# Altium schematic sheet Power.SchDoc
size B
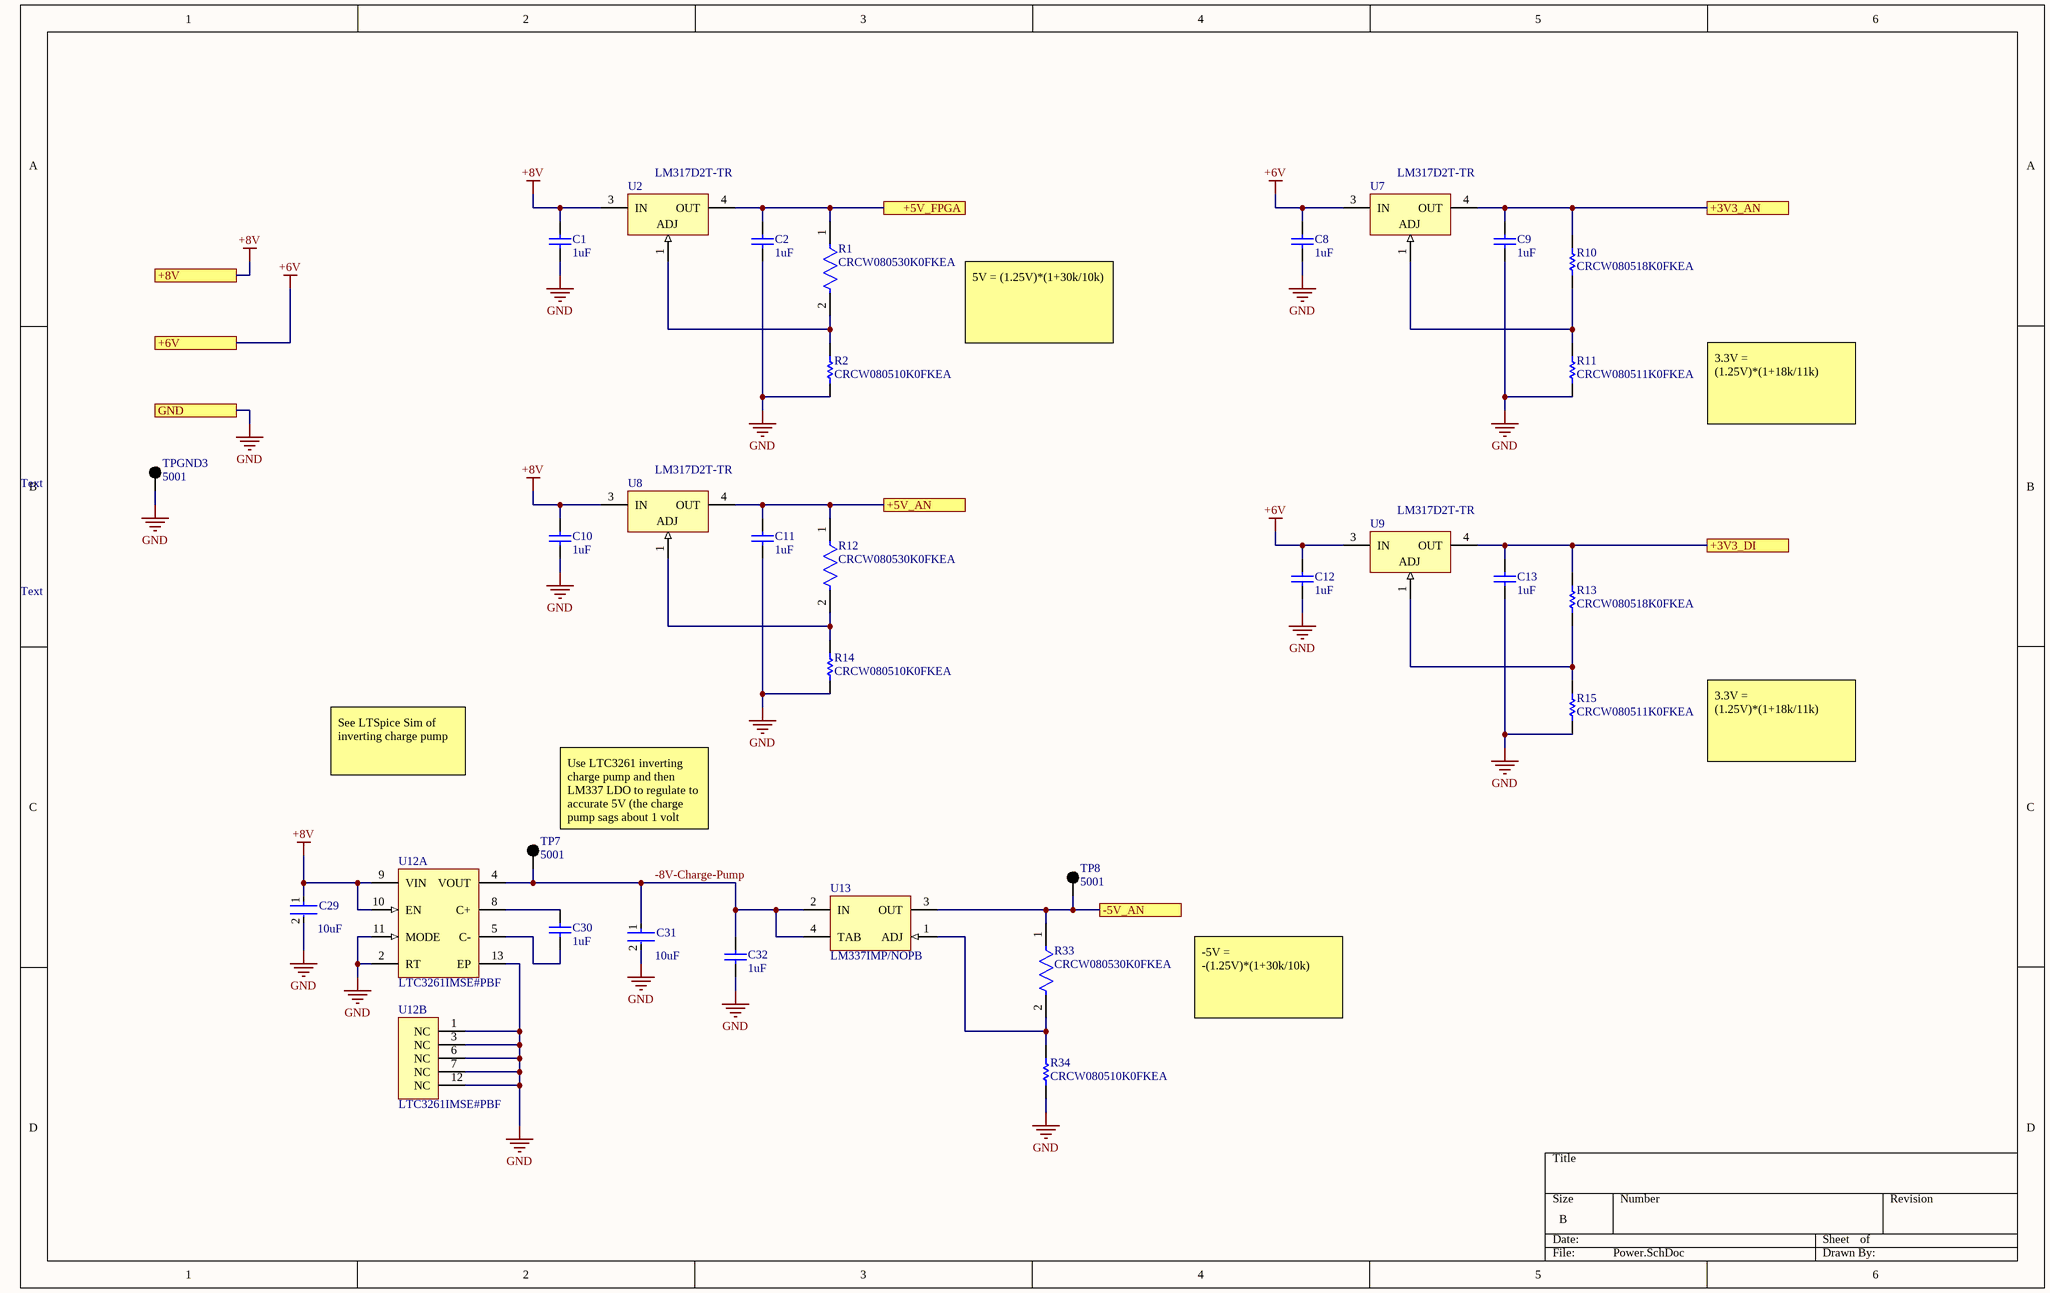
[diagram p0: Power.SchDoc]

## Parts
C1  1uF  [CAPC2013X100X50NL20T25]
C2  1uF  [CAPC2013X100X50NL20T25]
C8  1uF  [CAPC2013X100X50NL20T25]
C9  1uF  [CAPC2013X100X50NL20T25]
C10  1uF  [CAPC2013X100X50NL20T25]
C11  1uF  [CAPC2013X100X50NL20T25]
C12  1uF  [CAPC2013X100X50NL20T25]
C13  1uF  [CAPC2013X100X50NL20T25]
C29  Capacitance: 10uF  [FP-CGA5L-0_3-0_1-MFG]  (hidden comment: CGA5L1X7R1E106K160AC)
C30  1uF  [CAPC2013X100X50NL20T25]
C31  Capacitance: 10uF  [FP-CGA5L-0_3-0_1-MFG]  (hidden comment: CGA5L1X7R1E106K160AC)
C32  1uF  [CAPC2013X100X50NL20T25]
R1  CRCW080530K0FKEA  [FP-CRCW0805-e3-MFG]
R2  CRCW080510K0FKEA  [RESC2013X50X30NL20T20]
R10  CRCW080518K0FKEA  [RESC2013X50X30NL20T20]
R11  CRCW080511K0FKEA  [RESC2013X50X30NL20T20]
R12  CRCW080530K0FKEA  [FP-CRCW0805-e3-MFG]
R13  CRCW080518K0FKEA  [RESC2013X50X30NL20T20]
R14  CRCW080510K0FKEA  [RESC2013X50X30NL20T20]
R15  CRCW080511K0FKEA  [RESC2013X50X30NL20T20]
R33  CRCW080530K0FKEA  [FP-CRCW0805-e3-MFG]
R34  CRCW080510K0FKEA  [RESC2013X50X30NL20T20]
TP7  5001  [KSTN-5001]
TP8  5001  [KSTN-5001]
TPGND3  5001  [KSTN-5001]
U2  LM317D2T-TR  [TO-263_N]
U7  LM317D2T-TR  [TO-263_N]
U8  LM317D2T-TR  [TO-263_N]
U9  LM317D2T-TR  [TO-263_N]
U12  LTC3261IMSE#PBF  [LT-MSE-12-EDP_M]  (parts A,B of 2)
U13  LM337IMP/NOPB  [DCY0004A_L]

## Ports
+3V3_AN, +3V3_DI, +5V_AN, +5V_FPGA, +6V, +8V, -5V_AN, GND

## Nets
+6V: C8.2 C12.2 U7.3(IN) U9.3(IN) ; port +6V
+8V: C1.2 C10.2 C29.1 U2.3(IN) U8.3(IN) U12.9(VIN) U12.10(EN) ; port +8V
GND: C1.1 C2.1 C8.1 C9.1 C10.1 C11.1 C12.1 C13.1 C29.2 C31.2 C32.1 R2.2 R11.1 R14.2 R15.1 R34.2 TPGND3.1 U12.1(NC) U12.2(RT) U12.3(NC) U12.6(NC) U12.7(NC) U12.11(MODE) U12.12(NC) U12.13(EP) ; port GND
+3V3_AN: C9.2 R10.2 U7.4(OUT) ; port +3V3_AN
+3V3_DI: C13.2 R13.2 U9.4(OUT) ; port +3V3_DI
+5V_AN: C11.2 R12.1 U8.4(OUT) ; port +5V_AN
+5V_FPGA: C2.2 R1.1 U2.4(OUT) ; port +5V_FPGA
-5V_AN: R33.1 TP8.1 U13.3(OUT) ; port -5V_AN
-8V-Charge-Pump: C31.1 C32.2 TP7.1 U12.4(VOUT) U13.2(IN) U13.4(TAB)
NetC30_1: C30.1 U12.5(C-)
NetC30_2: C30.2 U12.8(C+)
NetR1_2: R1.2 R2.1 U2.1(ADJ)
NetR10_1: R10.1 R11.2 U7.1(ADJ)
NetR12_2: R12.2 R14.1 U8.1(ADJ)
NetR13_1: R13.1 R15.2 U9.1(ADJ)
NetR33_2: R33.2 R34.1 U13.1(ADJ)

## Notes on the sheet
- 5V = (1.25V)*(1+30k/10k)
- 3.3V = (1.25V)*(1+18k/11k)
- Text
- See LTSpice Sim of inverting charge pump
- (near TP7) Use LTC3261 inverting charge pump and then LM337 LDO to regulate to accurate 5V (the charge pump sags about 1 volt under load).
- -5V = -(1.25V)*(1+30k/10k)

## Library data of the parts
C1 C2 C8-C13 C30 C32 = CMP-2007-03716-1: Part Number: C0805X105K3RACTU; Manufacturer: Kemet
C29 C31 = CMP-08246-002126-1: Cap Ceramic 10uF 25V X7R 10% Pad SMD 1206 +125°C Automotive T/R; Case/Package: 1206; Thickness: 0.075inch; Ratings: AEC-Q200; Packaging: Tape and Reel; REACH SVHC: No SVHC; Composition: Ceramic; Tolerance: 10%; Depth: 1.6mm; Lead Free: Lead Free; Termination: SMD/SMT; Package Quantity: 1; Dielectric: X7R; Length: 3.2mm; Min Operating Temperature: -55°C; Voltage Rating: 25V; Max Operating Temperature: 125°C; Mount: Surface Mount; Case Code (Metric): 3216; Height: 1.6mm; Weight: 0.000571oz; Width: 0.063inch; Voltage Rating (DC): 25V; Case Code (Imperial): 1206
R1 R12 R33 = CMP-02407-008264-1: RES Thick Film, 30kΩ, 1%, 0.125W, 100ppm/°C, 0805; Max Power Dissipation: 125mW; Voltage Rating (DC): 150V; Resistance: 30kR; Contact Plating: Tin; Weight: 0.000194oz; Temperature Coefficient: 100ppm/°C; Packaging: Tape and Reel; Height: 0.45mm; Case Code (Imperial): 0805; Max Operating Temperature: 155°C; Case/Package: 0805; Package Quantity: 10; Case Code (Metric): 2012; Features: Automotive AEC-Q200; Mount: Surface Mount; Length: 2mm; Termination: SMD/SMT; Lead Free: Lead Free; Width: 0.049inch; Number of Pins: 2; Depth: 1.25mm; Min Operating Temperature: -55°C; Power Rating: 125mW; Voltage Rating: 150V; Military Standard: Not; Composition: Thick Film; Tolerance: 1%; Number of Terminations: 2; Radiation Hardening: No
R2 R14 R34 = CMP-2001-04908-1: Manufacturer: Vishay Dale; Part Number: CRCW080510K0FKEA
R10 R13 = CMP-2001-03588-1: Manufacturer: Vishay Dale; Part Number: CRCW080518K0FKEA
R11 R15 = CMP-2001-04924-1: Manufacturer: Vishay Dale; Part Number: CRCW080511K0FKEA
TP7 TP8 TPGND3 = CMP-2000-05181-1: Test Point, Black, 1-Pin THD, RoHS, Bulk; Manufacturer: Keystone; Other Names: 5001K; Catalog Drawings: 5000Series; Alternate Color: 5004K-ND / -TESTPOINTPCMINI.040"DYELLOW / 5003K-ND / -TESTPOINTPCMINI.040"DORANGE / 5002K-ND / -TESTPOINTPCMINI.040"DWHITE / 5000K-ND / -TESTPOINTPCMINI.040"DRED; Kits: DKTGRS232C-KIT-ND / -TTLCONVERTER; Online Catalog: ColorCodedTestPoints; Datasheet URL: https://ciiva.com/datasheet-click-2917627?src=ciiva&sig=bd195616; Mounting Type: 0.040"(1.02mm)HoleDiameter; Family: TestPoints; RoHS Information: RoHSComplianceStatement; Datasheet Version: Rev. G, 12/2008; Color: Black; Category: TestandMeasurement; Standard Package: 100; Manufacturer URL: http://www.keyelco.com/; Material: Base,Nylon46,UL94V-0; Type: PCTestPoint,Miniature; Terminal: 0.010"x0.020"(0.25mmx0.51mm)PhosphorBronzeWire,SilverPlated; Series: THM; Packaging: Bulk
U2 U7-U9 = CMP-0244-00094-1: 1.5A, 1.2V to 37V Adjustable Voltage Regulator, 3-Pin D2PAK, Tape and Reel; DatasheetVersion: 1/11/2011; PackageVersion: 2011; PackageDescription: 3-Pin Transistor Outline Package 2.54 mm Pitch, 15.4 mm Lead Span (D2PAK); ComponentLink2URL: http://www.st.com/internet/com/TECHNICAL_RESOURCES/TECHNICAL_LITERATURE/DATASHEET/CD00000455.pdf; PackageReference: TO-263; ComponentLink1Description: Manufacturer URL; ComponentLink2Description: Datasheet; ComponentLink1URL: http://www.st.com
U12 = CMP-0475-00250-1: High Voltage, Low Quiescent Current Inverting Charge Pump, 4.5 to 32 V Vin, 12-pin SOP (MSE-12-EDP), -40 to 125 degC, Pb-Free; Manufacturer: Linear Technology; Vin Max(V): 32; Max Iout(mA): 100; Isupply(mA): 0.06; Vin Min(V): 4.5; Ishutdown(uA): 2; Frequency(kHz): 500; Voutput: -Vin; RoHS: TRUE; ComponentLink3Description: Package Specification; Mounting Technology: Surface Mount; PackageReference: MSE-12-EDP; PackageVersion: Rev. G, 05/2013; ComponentLink1Description: Manufacturer URL; PartNumber: LTC3261IMSE#PBF; DatasheetVersion: Rev. B; ComponentLink2URL: http://cds.linear.com/docs/en/datasheet/3261fb.pdf; PackageDescription: 12-Pin Plastic MSOP, Exposed Die Pad, Body 4.039 x 3 mm, Pitch 0.65 mm; ComponentLink3URL: http://cds.linear.com/docs/en/packaging/05081666_G_MSE12.pdf; ComponentLink2Description: Datasheet; ComponentLink1URL: http://www.linear.com/
U13 = CMP-0062-01832-3: 3-Terminal Adjustable Negative Regulator, 4-pin SOT-223, Pb-Free; Manufacturer: Texas Instruments; PackageTopMarking: XYTT*N02A; CompType: LDO IC; PowerWise: N; Code_IPC: SOT223-4; ComponentLink1URL: http://www.ti.com/general/docs/lit/getliterature.tsp?genericPartNumber=LM337-N&fileType=pdf; PinCount: 4; PackageReference: DCY0004A; Code_JEDEC: TO-261-AA; PackageDescription: Molded SOT-223, 6.50 x 3.56 x 1.6mm Body, 4 Lead, 2.3mm Pitch; ComponentLink1Description: Datasheet URL; RoHS: Y